# Altium schematic sheet EasyMini_Connector_1.SchDoc
size Letter; SheetNumber: 1; SheetTotal: 1
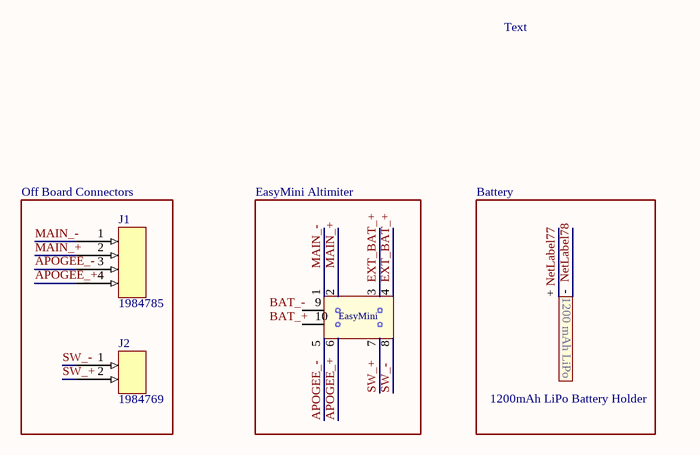
[diagram p0: EasyMini_Connector_1.SchDoc]

## Parts
*  EasyMini  [EasyMini-Footprint-1]  (value not drawn)  (part B of 2)
?  1200mAh LiPo Battery Holder  [LiPo Holder-Footprint-1]
J1  1984785  [CONN_1984785_PXC]
J2  1984769  [1984769-Footprint-1]

## Blocks framed on the sheet
Off Board Connectors: J1 J2
EasyMini Altimiter: *
Battery: ?

## Nets
APOGEE_+: *.6(APOGEE_+) J1.4
APOGEE_-: *.5(APOGEE_-) J1.3
EXT_BAT_+: *.3(EXT_BAT_+) *.4(EXT_BAT_-)
MAIN_+: *.2(MAIN_+) J1.2
MAIN_-: *.1(MAIN_-) J1.1
NetLabel77: ?.+
NetLabel78: ?.-
SW_+: *.7(SW_-) J2.2
SW_-: *.8(SW_+) J2.1

Not connected (* = marked no-connect by the designer): * 9(BAT_-) 10(BAT_+)

## Notes on the sheet
- Text
- Labels drawn without touching a wire or pin: BAT_+, BAT_-
- (in symbol CMP-00028-00013-6) 1200 mAh LiPo

## Library data of the parts
* = CMP-00028-00008-6
? = CMP-00028-00013-6: Holder for LiPo Pouch Type Battery
J1 = CMP-00028-00012-4: Terminal Block, Printed Circuit, 10 A, 160 V, 3.5 mm, 4, 3.5 mm, 1.2 mm, M2, PA
J2 = CMP-00028-00010-3: Terminal Block, Printed Circuit; 10 A; 160 V; 3.5 mm; 2; 3.5 mm; 1.2 mm; M2; PA